# EAGLE design u-nex_RELAY_SHIELD (EAGLE 6.5.0)
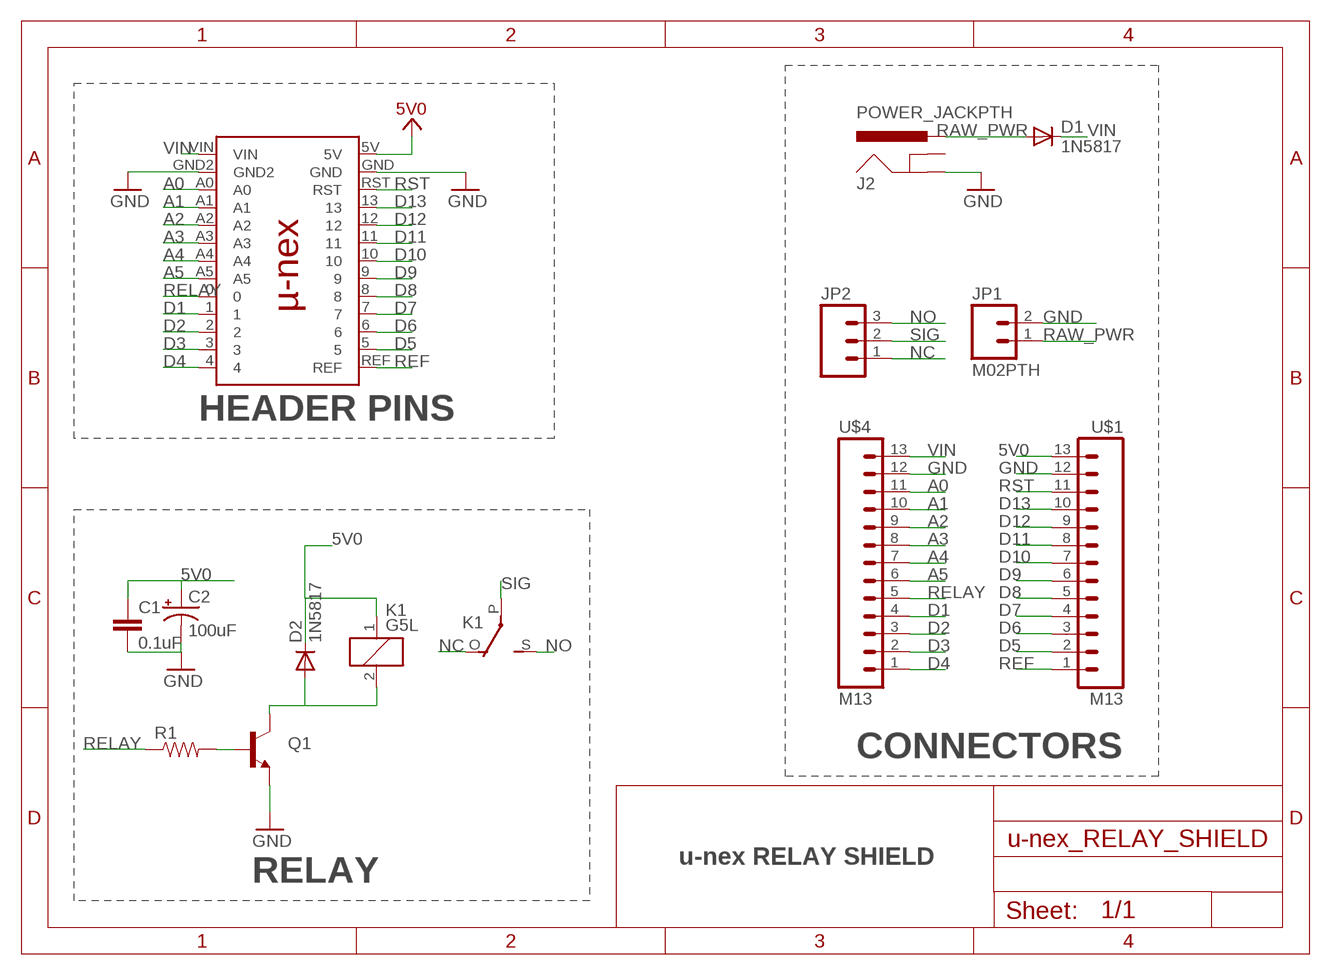
[diagram p0: schematic, sheet 1]

## Parts
C1  0.1uF  CAPPTH2  [CAP-PTH-SMALL2]
C2  100uF  CAP_POLPTH1  [CPOL-RADIAL-100UF-25V]
D1  1N5817  DIODEPTH  [DIODE-1N4001]
D2  1N5817  DIODEPTH  [DIODE-1N4001]
J2  POWER_JACKPTH  [POWER_JACK_PTH]
JP1  M02PTH  [1X02]
JP2  M03-SCREW-5MM  [SCREWTERMINAL-5MM-3]
K1  G5L  [G5LE]
Q1  TRANSISTOR_NPNTO92  [TO-92]
R1  RESISTORPTH-1/4W  [AXIAL-0.4]
U$1  M13  [1X13]
U$2  U-NEX  [U-NEX]
U$4  M13  [1X13]

## Nets
5V0: C1.1 C2.1(+) D2.C K1.1 U$1.13 U$2.5V
A0: U$2.A0 U$4.11
A1: U$2.A1 U$4.10
A2: U$2.A2 U$4.9
A3: U$2.A3 U$4.8
A4: U$2.A4 U$4.7
A5: U$2.A5 U$4.6
D1: U$2.1 U$4.4
D2: U$2.2 U$4.3
D3: U$2.3 U$4.2
D4: U$2.4 U$4.1
D5: U$1.2 U$2.5
D6: U$1.3 U$2.6
D7: U$1.4 U$2.7
D8: U$1.5 U$2.8
D9: U$1.6 U$2.9
D10: U$1.7 U$2.10
D11: U$1.8 U$2.11
D12: U$1.9 U$2.12
D13: U$1.10 U$2.13
GND: C1.2 C2.2(-) J2.GND JP1.2 Q1.1(E) U$1.12 U$2.GND U$2.GND2 U$4.12
N$1: D2.A K1.2 Q1.3(C)
N$2: Q1.2(B) R1.P$2
NC: JP2.1 K1.O(2:O)
NO: JP2.3 K1.S(2:S)
RAW_PWR: D1.A J2.PWR JP1.1
REF: U$1.1 U$2.REF
RELAY: R1.P$1 U$2.0 U$4.5
RST: U$1.11 U$2.RST
SIG: JP2.2 K1.P(2:P)
VIN: D1.C U$2.VIN U$4.13
Unconnected: J2.GNDBREAK

## Notes on the sheet
- HEADER PINS
- CONNECTORS
- u-nex RELAY SHIELD
- RELAY

## Library data of the parts
C1 = SparkFun-Capacitors:CAP: Capacitor Standard 0603 ceramic capacitor, and 0.1" leaded capacitor.
C2 = SparkFun-Capacitors:CAP_POL: Capacitor Polarized These are standard SMD and PTH capacitors. Normally 10uF, 47uF, and 100uF in electrolytic and tantalum varieties. Always verify the external diameter of the through hole cap, it varies with capacity, voltage, and manufacturer. The EIA devices should be standard.
D1 D2 = SparkFun-DiscreteSemi:DIODE: Diode These are standard reverse protection diodes and small signal diodes. SMA package can handle up to about 1A. SOD-323 can handle about 200mA. What the SOD-323 package when ordering, there are some mfgs out there that are 5-pin packages.
J2 = SparkFun-Connectors:POWER_JACK: Power Jack This is the standard 5.5mm barrel jack for power. The PTH is the most common, proven, reliable, footprint. The Slot footprint only works if the mill layer is transmitted to the PCB fab house so be warned. Spark Fun Electronics SKU : PRT-00119 SMT: CONN-08106 Mating wall wart : TOL-00298 (and others)
JP1 = SparkFun-Connectors:M02: Standard 2-pin 0.1" header. Use with - straight break away headers ( PRT-00116) - right angle break away headers (PRT-00553) - swiss pins (PRT-00743) - machine pins (PRT-00117) - female headers (PRT-00115) Molex polarized connector foot print use with: PRT-08233 with associated crimp pins and housings. 2.54_SCREWTERM for use with PRT-10571. 3.5mm Screw Terminal footprints for PRT-08084 5mm Screw Terminal footprints for use with PRT-08433
JP2 = SparkFun-Connectors:M03: Header 3 Standard 3-pin 0.1" header. Use with straight break away headers (SKU : PRT-00116), right angle break away headers (PRT-00553), swiss pins (PRT-00743), machine pins (PRT-00117), and female headers (PRT-00115). Molex polarized connector foot print use with SKU : PRT-08232 with associated crimp pins and housings.
K1 = relay:G5L: RELAY 1 x switch, 10 A/120 V AC, 8 A/30 V ADC, Omron; OC_FARNELL: unknown; OC_NEWARK: unknown
Q1 = SparkFun-DiscreteSemi:TRANSISTOR_NPN: Generic NPN BJT MMBT2222A - TRANS-08049 (SOT-23, 1A 40V) MPSA42 - TRANS-09116 (SOT-23, 500mA 300V) MMBT5088LT1G - TRANS-11160 (SOT-23, 50 mA 30V)
R1 = SparkFun-Resistors:RESISTOR: Resistor Basic schematic elements and footprints for 0603, 1206, and PTH resistors.
U$1 U$4 = Frenoy_custom_GOA:M13
U$2 = Frenoy_Custom:U-NEX

## Net classes
0 default: width 0.254 mm, drill 0.61 mm, clearance 0.254 mm
1 power: width 0.254 mm, drill 0.61 mm, clearance 0.254 mm
2 gnd: width 0.254 mm, drill 0.61 mm, clearance 0.254 mm
3 usbvcc: width 0.254 mm, drill 0.61 mm, clearance 0.254 mm
4 aref: width 0.254 mm, drill 0.61 mm, clearance 0.254 mm

## Board
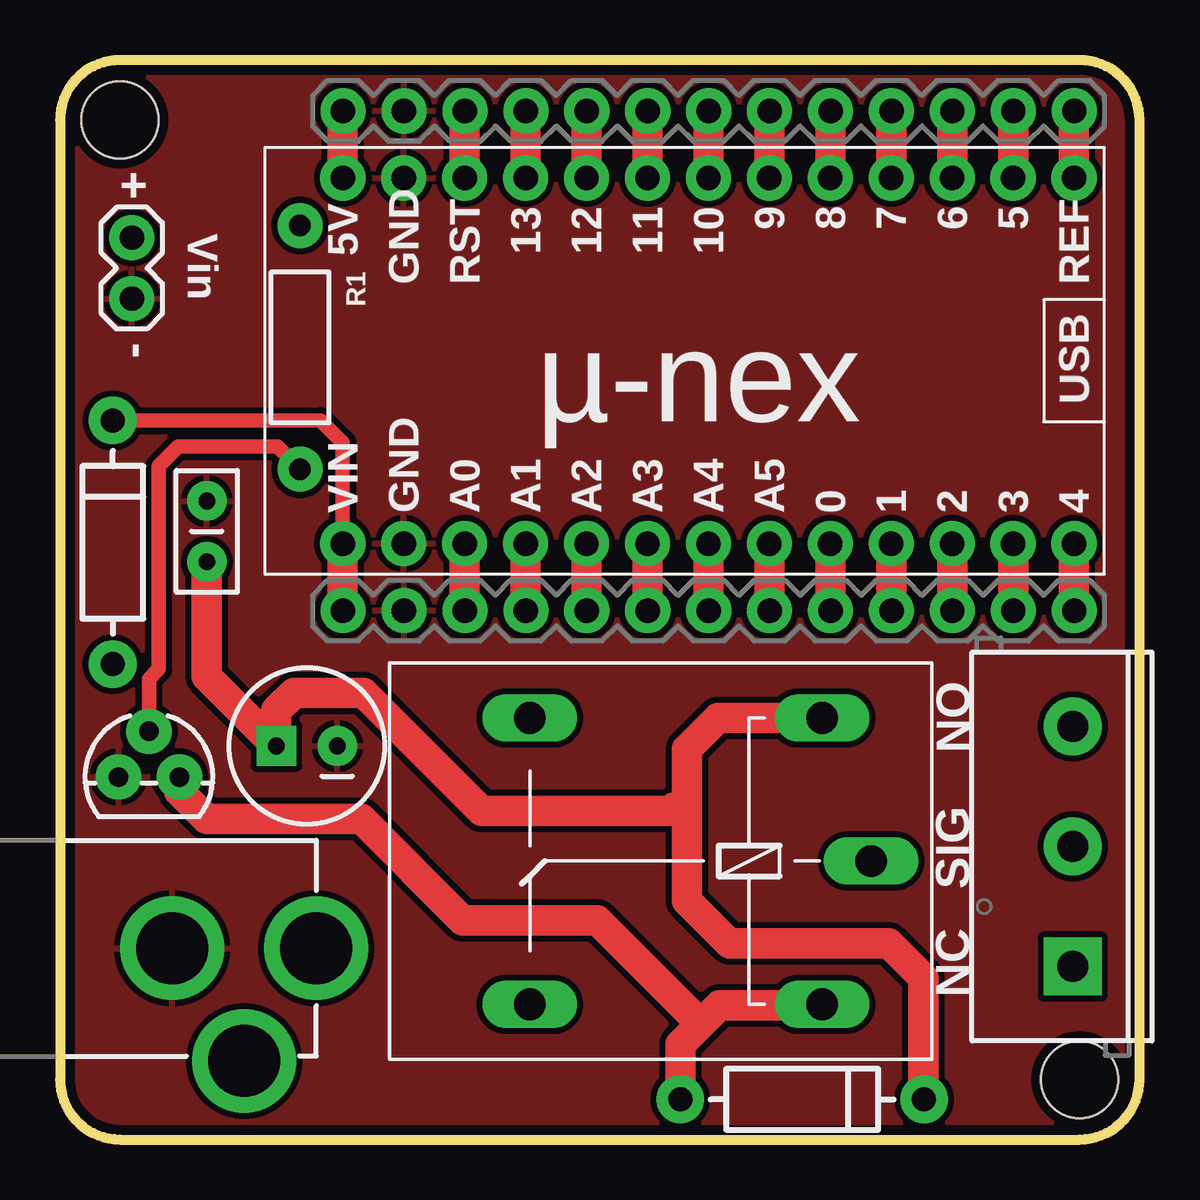
[diagram p1: board, top side]
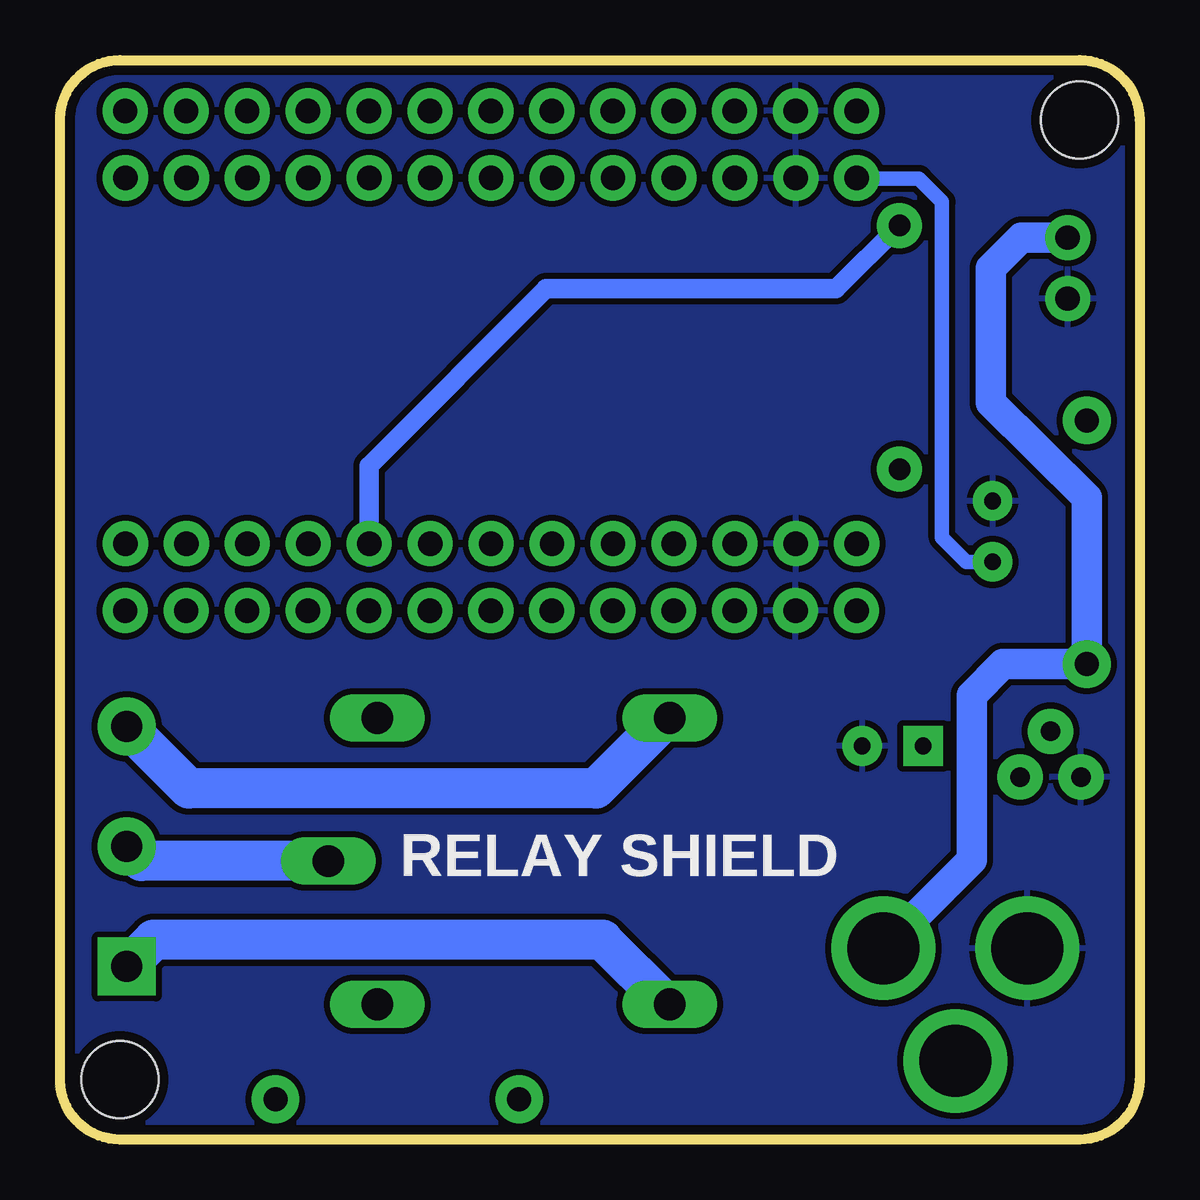
[diagram p2: board, bottom side, seen from below]

Size 45 x 45 mm. Coordinates in mm from the lower left corner, seen from the top.
Outline: 42.5,45 2.5,45 arc90 0,42.5 0,2.5 arc90 2.5,0 42.5,0 arc90 45,2.5 45,42.5 arc90 42.5,45
Copper layers (1*16): Top 0.035mm / dielectric 1.5mm / Bottom 0.035mm
Design rules "default": minimum track width 9.5mil, minimum drill 16mil, track to track 8mil, track to pad 8mil, pad to pad 8mil, via to via 8mil, smd to smd 8mil, copper to edge 16mil, drill to drill 8mil, minimum pad ring 10mil, minimum via ring 8mil, stop-mask expansion 8mil, vias tented up to drill 20mil, thermal gap 10mil
Holes 3.2 mm at 2.5,42.5 42.5,2.5

### Footprints (pad centres in the part's own frame; a part is rotated, then mirrored left to right if it is on the bottom)
CAP-PTH-SMALL2 = drill 0.7 pad 1.651: 1 0,0; 2 2.54,0
CPOL-RADIAL-100UF-25V = drill 0.7 pad 1.651 square: 1 1.27,0 | drill 0.7 pad 1.651: 2 -1.27,0
DIODE-1N4001 = drill 1 pad 1.981: A -5.08,0; C 5.08,0
POWER_JACK_PTH = drill 2.997 pad 4.318: GND 0,7.7; GNDBREAK 4.7,10.7; PWR 0,13.7
1X02 = drill 1.016 pad 1.88: 1 0,0; 2 2.54,0
SCREWTERMINAL-5MM-3 = drill 1.3 pad 2.413 square: 1 0,0 | drill 1.3 pad 2.413: 2 5,0; 3 10,0
G5LE = drill 1.321 long: 1 -7.493,-5.969; 2 -7.493,5.969; O 4.699,5.969; P -9.525,0; S 4.699,-5.969
TO-92 = drill 0.813 pad 1.88: 1 -1.27,0; 2 0,1.905; 3 1.27,0
AXIAL-0.4 = drill 0.9 pad 1.88: P$1 -5.08,0; P$2 5.08,0
1X13 = drill 1.016 pad 1.88: 1 0,0; 2 2.54,0; 3 5.08,0; 4 7.62,0; 5 10.16,0; 6 12.7,0; 7 15.24,0; 8 17.78,0; 9 20.32,0; 10 22.86,0; 11 25.4,0; 12 27.94,0; 13 30.48,0
U-NEX = drill 1.016 pad 1.88: 0 1.27,11.43; 1 1.27,8.89; 2 1.27,6.35; 3 1.27,3.81; 4 1.27,1.27; 5 16.51,3.81; 5V 16.51,31.75; 6 16.51,6.35; 7 16.51,8.89; 8 16.51,11.43; 9 16.51,13.97; 10 16.51,16.51; 11 16.51,19.05; 12 16.51,21.59; 13 16.51,24.13; A0 1.27,26.67; A1 1.27,24.13; A2 1.27,21.59; A3 1.27,19.05; A4 1.27,16.51; A5 1.27,13.97; GND 16.51,29.21; GND2 1.27,29.21; REF 16.51,1.27; RST 16.51,26.67; VIN 1.27,31.75

### Placement (x,y rotation side)
C1  6.12,24.08 90 top
C2  10.29,16.41 180 top
D1  2.2,24.89 90 top
D2  30.94,1.68 0 top
J2  -3.02,7.97 270 top
JP1  3,37.59 270 top
JP2  42.21,7.21 90 top
K1  24.28,11.61 180 top
Q1  3.71,15.11 0 top
R1  10.01,33.02 270 top
U$1  42.28,42.88 180 top
U$2  43.54,23.57 90 top
U$4  42.28,22.05 180 top

### Tracks (layer width: path | path; a pad name or v marks a point on that pad's centre or on a via)
5V0
  Top 1.27: 26.14,13.36 26.14,16.28 27.43,17.58 K1.1 | 26.14,13.36 25.65,13.84 25.6,13.84 25.45,13.69 17.58,13.69 12.65,18.62 9.75,18.62 9.02,17.89 C2.1 6.12,19.3 C1.1 | 26.14,13.36 26.14,9.96 27.91,8.18 34.54,8.18 35.99,6.73 35.99,1.7 D2.C | U$2.5V 11.79,42.87 U$1.13
  Bottom 0.61: C1.1 7.21,24.08 8.23,25.09 8.23,39.09 9.2,40.06 11.77,40.06
  Bottom 0.813: 11.77,40.06 U$2.5V
A0
  Top 1.27: U$2.A0 U$4.11
A1
  Top 1.27: U$2.A1 U$4.10
A2
  Top 1.27: U$2.A2 U$4.9
A3
  Top 1.27: U$2.A3 U$4.8
A4
  Top 1.27: U$2.A4 U$4.7
A5
  Top 1.27: U$2.A5 U$4.6
D1
  Top 1.27: U$2.1 U$4.4
D2
  Top 1.27: U$2.2 U$4.3
D3
  Top 1.27: U$2.3 U$4.2
D4
  Top 1.27: U$2.4 U$4.1
D5
  Top 1.27: U$2.5 39.73,42.87 U$1.2
D6
  Top 1.27: U$2.6 37.19,42.87 U$1.3
D7
  Top 1.27: U$2.7 34.65,42.87 U$1.4
D8
  Top 1.27: U$2.8 32.11,42.87 U$1.5
D9
  Top 1.27: U$2.9 29.57,42.87 U$1.6
D10
  Top 1.27: U$2.10 27.03,42.87 U$1.7
D11
  Top 1.27: U$2.11 24.49,42.87 U$1.8
D12
  Top 1.27: U$2.12 21.95,42.87 U$1.9
D13
  Top 1.27: U$2.13 19.41,42.87 U$1.10
GND
  pour Top (isolate 0.254): -0.08,45.17 45.15,45.3 44.92,-0.13 -0.13,-0.13
  pour Bottom (isolate 0.254): -0.13,45.25 45,45.15 44.9,-0.1 -0.13,0.03
N$1
  Top 1.27: Q1.3 4.98,14.5 6.12,13.36 12.57,13.36 16.79,9.14 22.4,9.14 26.72,4.83 | D2.A 25.86,3.96 26.72,4.83 | 26.72,4.83 27.48,5.59 31.73,5.59 K1.2
N$2
  Top 0.61: Q1.2 3.71,19.2 4.12,19.61 4.12,28.07 4.93,28.88 9.07,28.88 R1.P$2
NC
  Bottom 1.676: K1.O 19.68,5.64 22.38,8.33 41.1,8.33 JP2.1
NO
  Bottom 1.676: K1.S 19.71,17.58 22.66,14.63 39.63,14.63 JP2.3
RAW_PWR
  Bottom 1.27: J2.PWR 6.99,11.67 6.99,18.52 5.69,19.81 D1.A 2.2,26.76 6.2,30.71 6.2,36.32 4.93,37.59 JP1.1
REF
  Top 1.27: U$2.REF 42.27,42.87 U$1.1
RELAY
  Top 1.27: U$2.0 U$4.5
  Bottom 0.813: R1.P$1 12.65,35.46 24.74,35.46 32.12,28.08 32.12,24.29 32.11,24.28 U$2.0
RST
  Top 1.27: U$2.RST 16.87,42.87 U$1.11
SIG
  Bottom 1.676: K1.P 41.61,11.61 JP2.2
VIN
  Top 0.61: D1.C 10.87,29.97 11.79,29.06 11.79,24.86
  Top 1.27: U$4.13 U$2.VIN 11.79,24.86

### Text on the board
bPlace: RELAY SHIELD
tNames: + | Vin | - | NO | SIG | NC